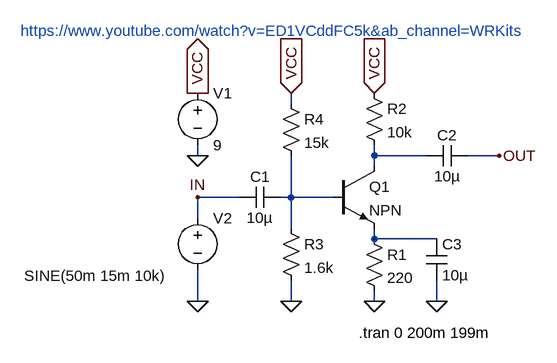
[diagram p0: schematic polarization_transistor.asc]
polarization_transistor.asc, the LTspice schematic file:
Version 4
SHEET 1 880 680
WIRE 64 16 64 0
WIRE -80 96 -80 80
WIRE 192 96 192 80
WIRE 272 96 192 96
WIRE 384 96 336 96
WIRE 192 112 192 96
WIRE -16 160 -80 160
WIRE 64 160 64 96
WIRE 64 160 48 160
WIRE 128 160 64 160
WIRE -80 192 -80 160
WIRE 64 208 64 160
WIRE 192 224 192 208
WIRE 288 224 192 224
WIRE -80 320 -80 272
WIRE 64 320 64 288
WIRE 192 320 192 304
WIRE 288 320 288 288
FLAG 192 320 0
FLAG -80 96 0
FLAG -80 0 VCC
IOPIN -80 0 Out
FLAG 192 0 VCC
IOPIN 192 0 In
FLAG -80 320 0
FLAG 64 0 VCC
IOPIN 64 0 In
FLAG 64 320 0
FLAG -80 160 IN
FLAG 384 96 OUT
FLAG 288 320 0
SYMBOL npn 128 112 R0
SYMATTR InstName Q1
SYMBOL res 176 208 R0
SYMATTR InstName R1
SYMATTR Value 220
SYMBOL voltage -80 -16 R0
WINDOW 123 0 0 Left 0
WINDOW 39 0 0 Left 0
SYMATTR InstName V1
SYMATTR Value 9
SYMBOL res 176 -16 R0
SYMATTR InstName R2
SYMATTR Value 10k
SYMBOL voltage -80 176 R0
WINDOW 123 0 0 Left 0
WINDOW 39 0 0 Left 0
WINDOW 3 -267 105 Left 2
SYMATTR InstName V2
SYMATTR Value SINE(50m 15m 10k)
SYMBOL res 48 192 R0
SYMATTR InstName R3
SYMATTR Value 1.6k
SYMBOL res 48 0 R0
SYMATTR InstName R4
SYMATTR Value 15k
SYMBOL cap 48 144 R90
WINDOW 0 0 32 VBottom 2
WINDOW 3 32 32 VTop 2
SYMATTR InstName C1
SYMATTR Value 10µ
SYMBOL cap 336 80 R90
WINDOW 0 0 32 VBottom 2
WINDOW 3 32 32 VTop 2
SYMATTR InstName C2
SYMATTR Value 10µ
SYMBOL cap 272 224 R0
SYMATTR InstName C3
SYMATTR Value 10µ
TEXT 168 368 Left 2 !.tran 0 200m 199m
TEXT -352 -96 Left 2 ;https://www.youtube.com/watch?v=ED1VCddFC5k&ab_channel=WRKits

The netlist it stands for:
* polarization_transistor.asc
Q1 N001 N002 N003 0 NPN
R1 N003 0 220
V1 VCC 0 9
R2 VCC N001 10k
V2 IN 0 SINE(50m 15m 10k)
R3 N002 0 1.6k
R4 VCC N002 15k
C1 N002 IN 10µ
C2 OUT N001 10µ
C3 N003 0 10µ
.model NPN NPN
.model PNP PNP
.lib standard.bjt
.tran 0 200m 199m
* https://www.youtube.com/watch?v=ED1VCddFC5k&ab_channel=WRKits
.backanno
.end